# EasyEDA schematic lab04_2020-11-30_18-55-13.json
TITLE: Sheet_1; REV: 1.0; Date: 2020-11-30; Sheet: 1/1; Drawn By: ersinalcinn; Company: Your Company
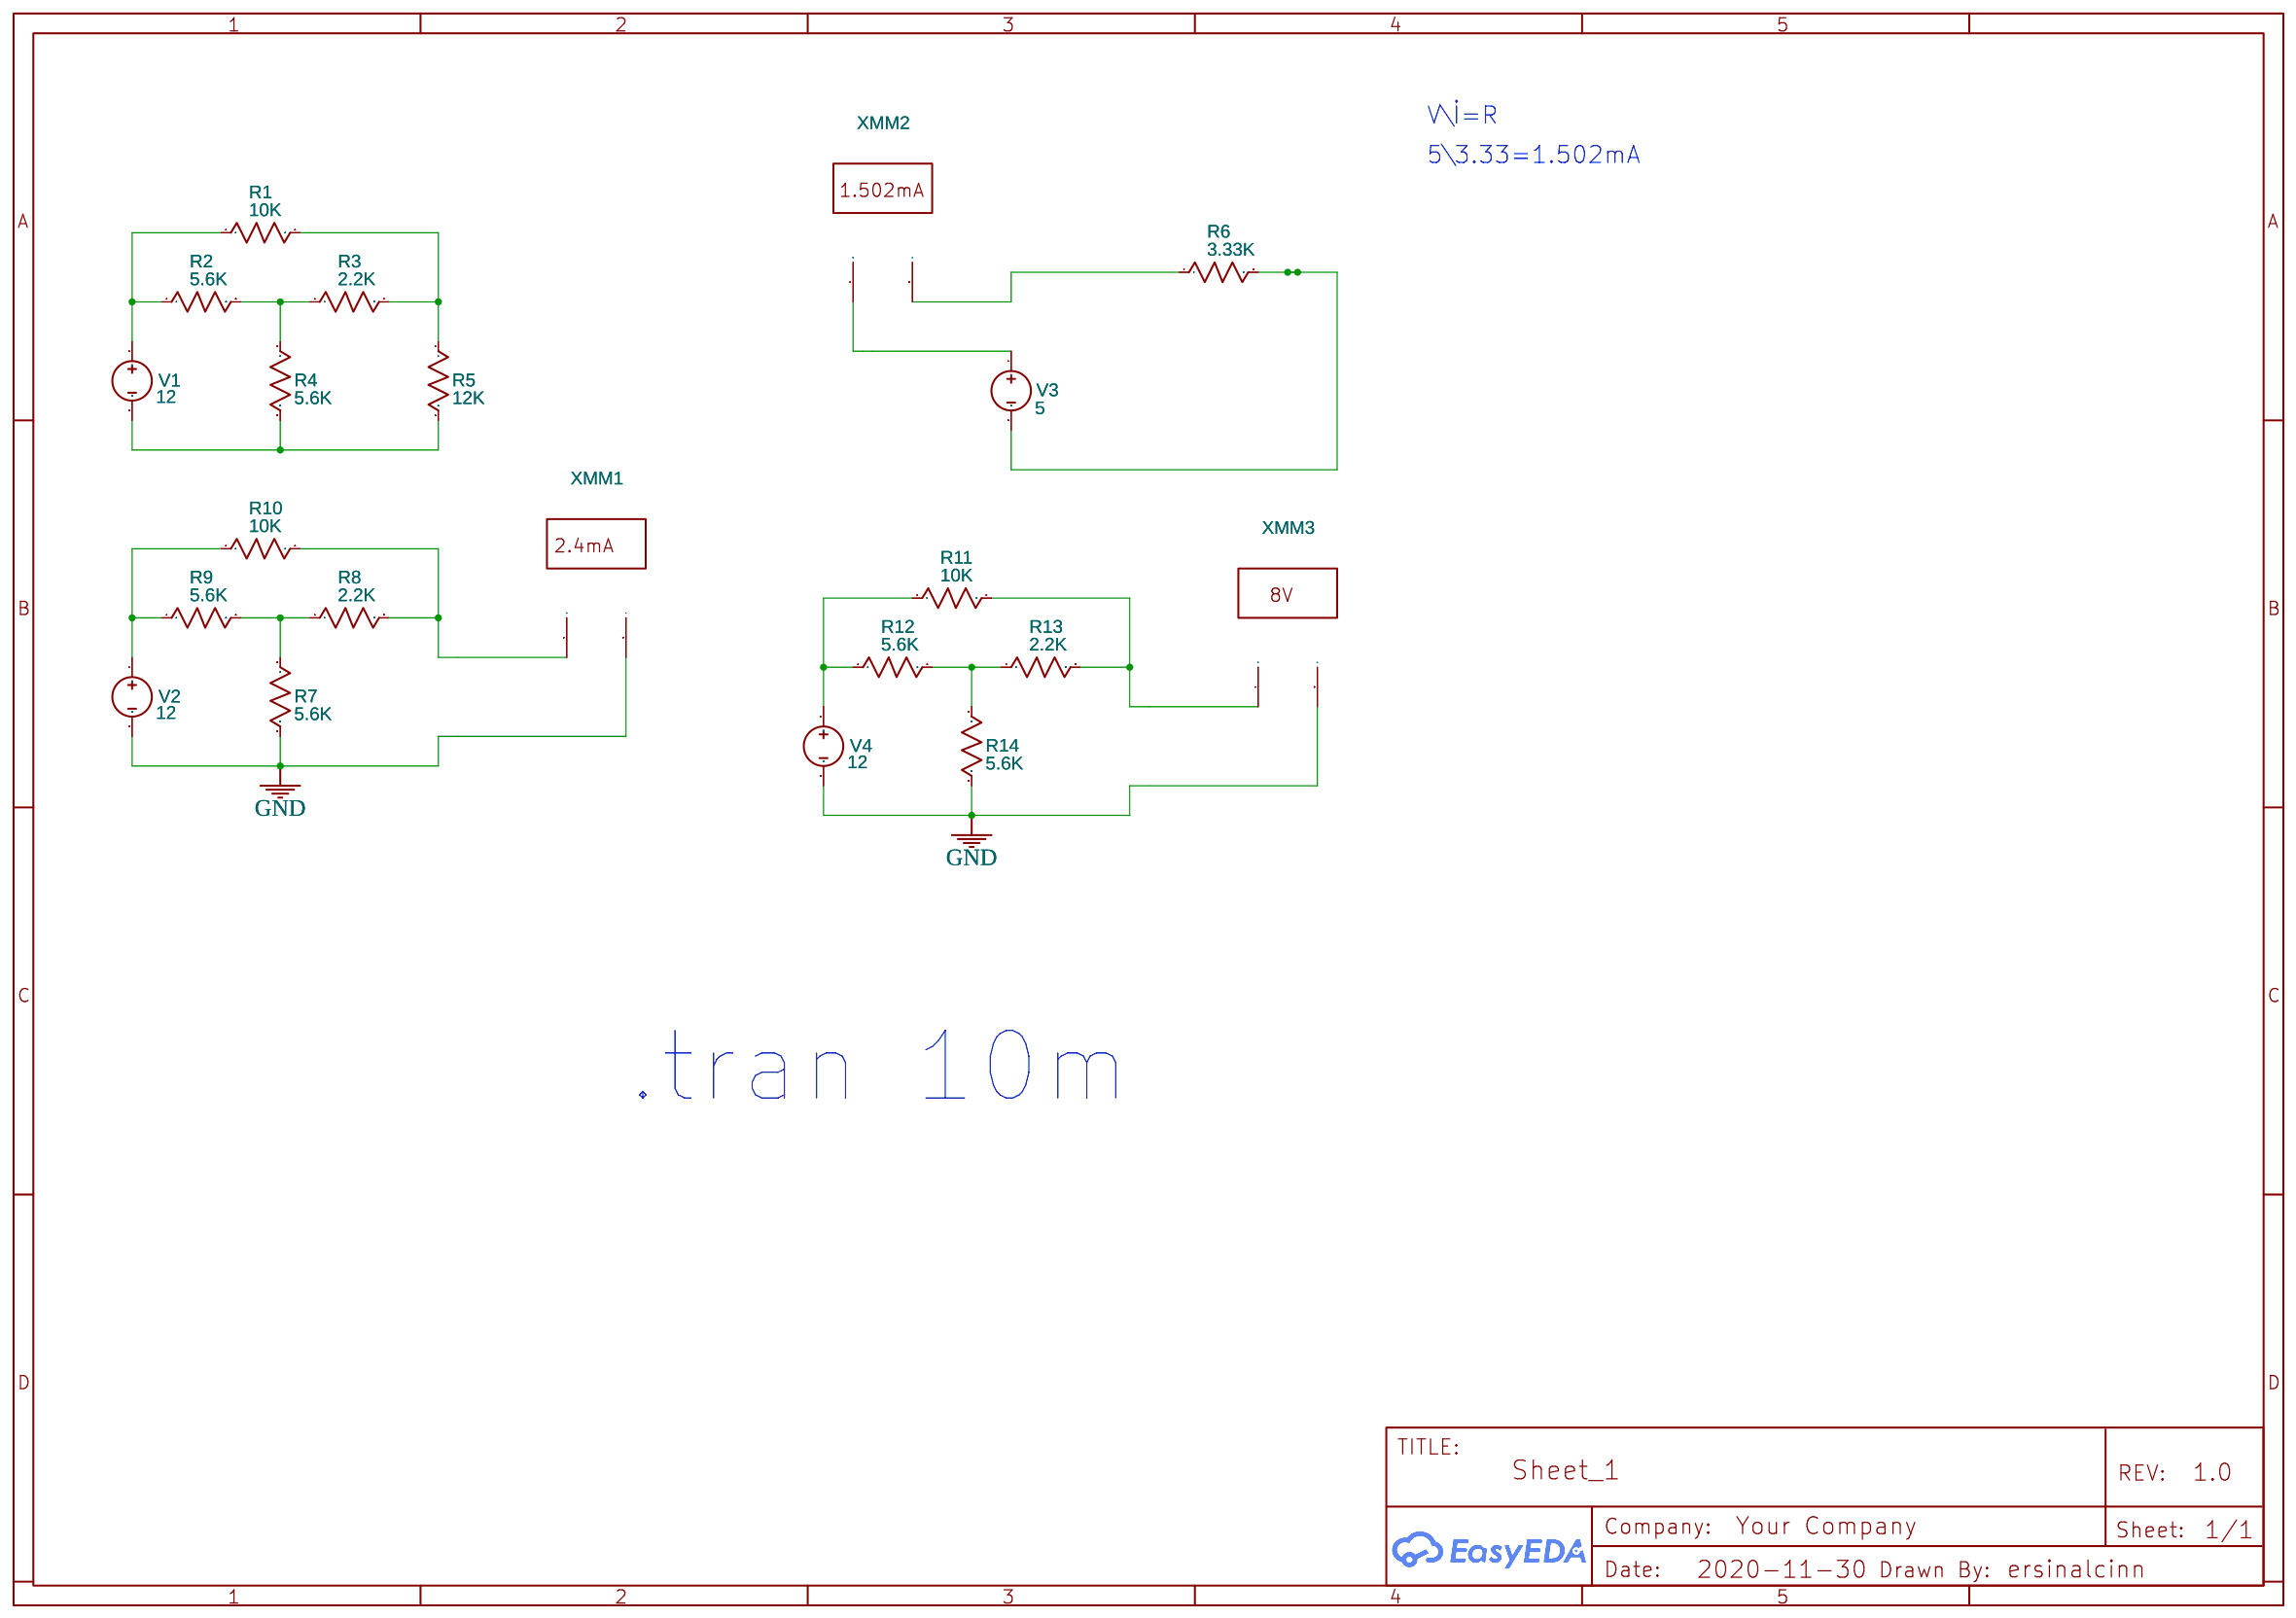
[diagram p0: schematic sheet]

## Parts
R1  10K  [AXIAL-0.3]
R2  5.6K  [AXIAL-0.3]
R3  2.2K  [AXIAL-0.3]
R4  5.6K  [AXIAL-0.3]
R5  12K  [AXIAL-0.3]
R6  3.33K  [AXIAL-0.3]
R7  5.6K  [AXIAL-0.3]
R8  2.2K  [AXIAL-0.3]
R9  5.6K  [AXIAL-0.3]
R10  10K  [AXIAL-0.3]
R11  10K  [AXIAL-0.3]
R12  5.6K  [AXIAL-0.3]
R13  2.2K  [AXIAL-0.3]
R14  5.6K  [AXIAL-0.3]
V1  12  [HDR1X2]
V2  12  [HDR1X2]
V3  5  [HDR1X2]
V4  12  [HDR1X2]
XMM1  Multimeter
XMM2  Multimeter
XMM3  Multimeter

## Library data of the parts
R1-R14 = Resistor_US: Resistance: 1k; Contributor: EasyEDA; Supplier: YUJING
V1-V4 = VDC: Contributor: EasyEDA; sim: true
XMM1 XMM2 = MULTIMETER: Supplier: LCSC; Multimeter Type: Amper; Power Type: AC; Voltmeter resistance: 10μ; Ammeter resistance: 1G; NameDisplay: 0; Contributor: EasyEDA; sim: true
XMM3 = MULTIMETER: Supplier: LCSC; Multimeter Type: Volt; Power Type: AC; Voltmeter resistance: 10μ; Ammeter resistance: 1G; NameDisplay: 0; Contributor: EasyEDA; sim: true

## Nets
GND: R7.2 R14.2 V2.2 V4.2 XMM1.2(I) XMM3.2(I)
Net-(R1-1): R1.1 R2.1 V1.1
Net-(R1-2): R1.2 R3.2 R5.1
Net-(R2-2): R2.2 R3.1 R4.1
Net-(R4-2): R4.2 R5.2 V1.2
Net-(R6-1): R6.1 XMM2.2(I)
Net-(R6-2): R6.2 V3.2
Net-(R7-1): R7.1 R8.1 R9.2
Net-(R8-2): R8.2 R10.2 XMM1.1(+)
Net-(R9-1): R9.1 R10.1 V2.1
Net-(R11-1): R11.1 R12.1 V4.1
Net-(R11-2): R11.2 R13.2 XMM3.1(+)
Net-(R12-2): R12.2 R13.1 R14.1
Net-(V3-1): V3.1 XMM2.1(+)

## Notes on the sheet
- V\İ=R
- 5\3.33=1.502mA
- .tran 10m
